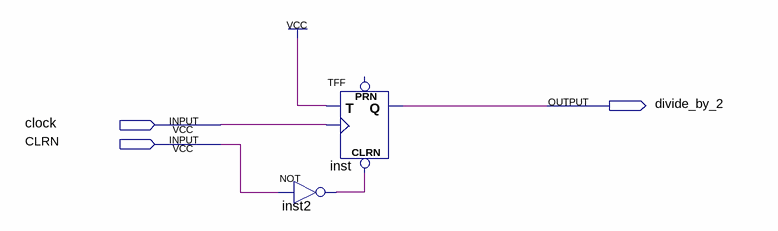
[diagram p0: schematic sheet]
// Quartus schematic divide_by_2.bdf as structural Verilog: 2 symbols, 3 pins
module divide_by_2 (
  input  clock,
  input  CLRN,
  output divide_by_2
);

  wire inst2_out;

  TFF inst (.CLRN(inst2_out), .T(1'b1), .CLK(clock), .Q(divide_by_2));  // open: PRN
  not inst2 (inst2_out, CLRN);
endmodule
